# EAGLE design candy (EAGLE 9.0.1)
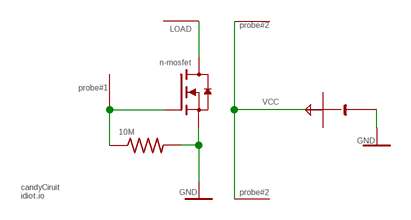
[diagram p0: schematic, sheet 1]

## Parts
10M  R-US_R1206  [R1206]
N-MOSFET  n-mosfet  N-MOSFETREGULAR  [SOT323]
U$1  SMDPAD  [PADSMD]
U$4  SMDPAD  [PADSMD]
U$5  SMDPAD  [PADSMD]
U$7  CR2032LINX  [CR2032-LINX]
VCC  SMDPAD  [PADSMD]

## Nets
GND: 10M.2 N-MOSFET.2S(S) U$7.-
LOAD: N-MOSFET.3D(D) U$4.P$1
N$1: 10M.1 N-MOSFET.1G(G) U$1.P$1
VCC: U$5.P$1 U$7.+ U$7.+2(+) VCC.P$1

## Notes on the sheet
- probe#2
- probe#1
- probe#2
- candyCiruit
  idiot.io

## Library data of the parts
10M = adafruit:R-US_: RESISTOR, American symbol
N-MOSFET = TinyTony_ShenzenReady:N-MOSFET
U$1 U$4 U$5 VCC = TinyTony_ShenzenReady:SMDPAD
U$7 = TinyTony_ShenzenReady:CR2032

## Board
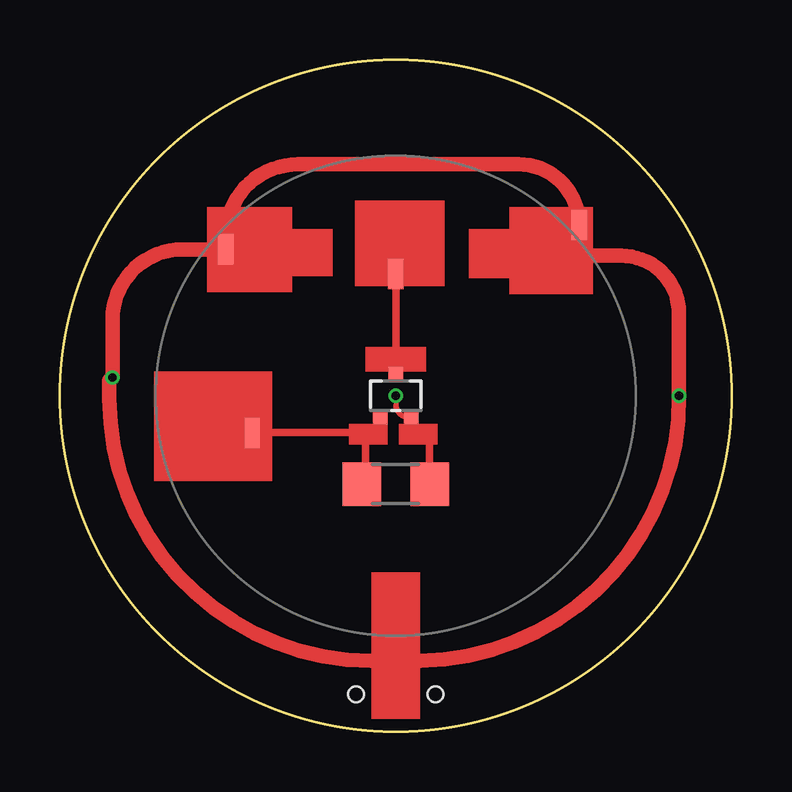
[diagram p1: board, top side]
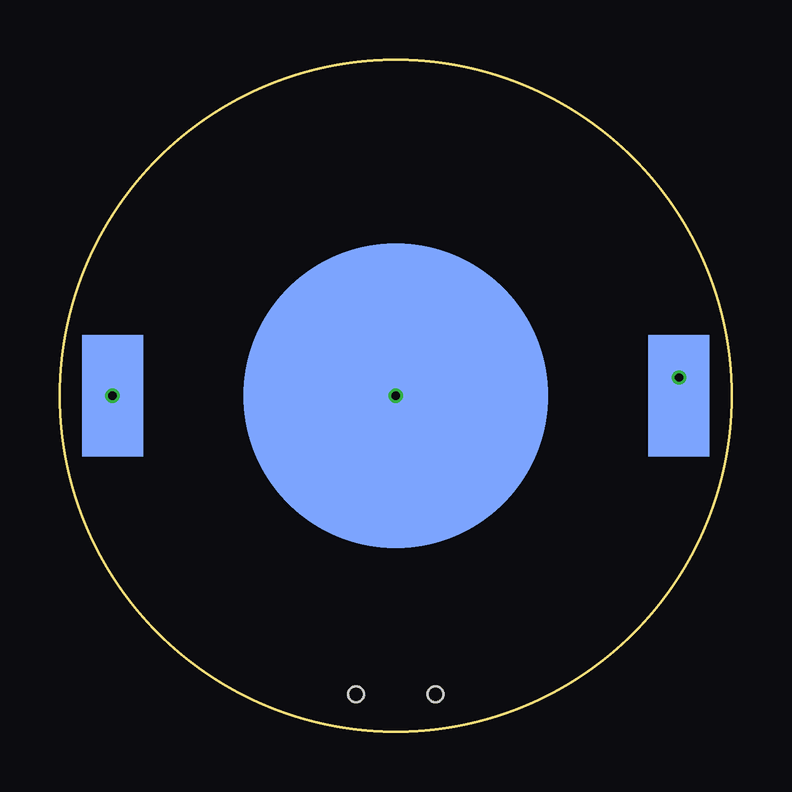
[diagram p2: board, bottom side, seen from below]

Size 28 x 28 mm. Coordinates in mm from the lower left corner, seen from the top.
Outline: circle at 14,14 radius 14
Copper layers (1*16): Top 0.018mm / dielectric 1.55mm / Bottom 0.018mm
Design rules "eC_2Layer_PClass6_BaseCopperO18_eCDefault": minimum track width 0.15mm, minimum drill 0.35mm, track to track 0.15mm, track to pad 0.15mm, pad to pad 0.15mm, via to via 0.15mm, smd to smd 0mil, copper to edge 0.25mm, drill to drill 0.35mm, minimum pad ring 0.175mm, minimum via ring 0.125mm, stop-mask expansion 0mil, vias tented up to drill 0.45mm, thermal gap 0.2mm
Holes 0.65 mm at 15.65,1.55 12.35,1.55

### Footprints (pad centres in the part's own frame; a part is rotated, then mirrored left to right if it is on the bottom)
R1206 = smd 1.6 x 1.803: 1 -1.422,0; 2 1.422,0
SOT323 = smd 0.6 x 0.55: 1G -0.65,-0.925; 2S 0.65,-0.925; 3D 0,0.925
PADSMD = smd 0.635 x 1.27: P$1 0,0
CR2032-LINX = smd 2.54 x 5.08: + 11.811,0; +2 -11.811,0 | smd 12.7 x 12.7: - 0,0

### Placement (x,y rotation side)
10M  14,10.32 0 top
N-MOSFET  14,14 0 top
U$1  8.01,12.44 0 top
U$4  14,19.08 0 top
U$5  21.65,21.11 0 top
U$7  14,14 0 bottom
VCC  6.92,20.1 0 top

### Tracks (layer width: path | path; a pad name or v marks a point on that pad's centre or on a via)
GND  (via drill 0.35)
  Top 0.203: U$7.- 14,13.6 arc90 N-MOSFET.2S 14.45,12.78 arc90 15.4,12.35 | 10M.2 arc-90 15.4,10.91
  Top 0.305: 15.4,10.91 15.4,12.35
  other vias: 14,14
LOAD
  Top 0.203: 13.98,19.22 arc-90 U$4.P$1 arc90 13.98,19.22
  Top 0.305: U$4.P$1 N-MOSFET.3D
N$1
  Top 0.203: N-MOSFET.1G 13.15,12.9 arc-90 12.73,12.48 | 12.73,10.42 arc-90 10M.1 | 8.05,12.48 arc90 U$1.P$1
  Top 0.305: 12.73,10.42 12.73,12.48 8.05,12.48
VCC  (via drill 0.35)
  Top 0.152: 2.06,14.64 arc-90 v2.19,14.76 | 15.02,2.95 12.98,2.95
  Top 0.203: 6.92,20.63 VCC.P$1 arc-90 VCC.P$1 | 22.13,19.84 arc-90 21.62,20.35 21.62,21.09 arc-90 U$5.P$1
  Top 0.61: 6.92,20.63 arc-90 9.94,23.65 19.11,23.65 arc-90 U$5.P$1 | VCC.P$1 5.11,20.1 arc90 2.19,17.18 v2.19,14.76 | 22.13,19.84 23.4,19.84 arc-90 25.81,17.43 U$7.+2 arc-90 15.02,2.95 | 12.98,2.95 arc-90 2.06,13.87 2.06,14.64
  Bottom 0.203: U$7.+ v2.19,14.76
  other vias: 25.81,14
(copper drawn outside any net)
  shapes: Top area x10

### Text on the board
200bmp: G:/_GIT/candy/artwork.bmp